# EAGLE design schematic_v1 (EAGLE 9.6.2)
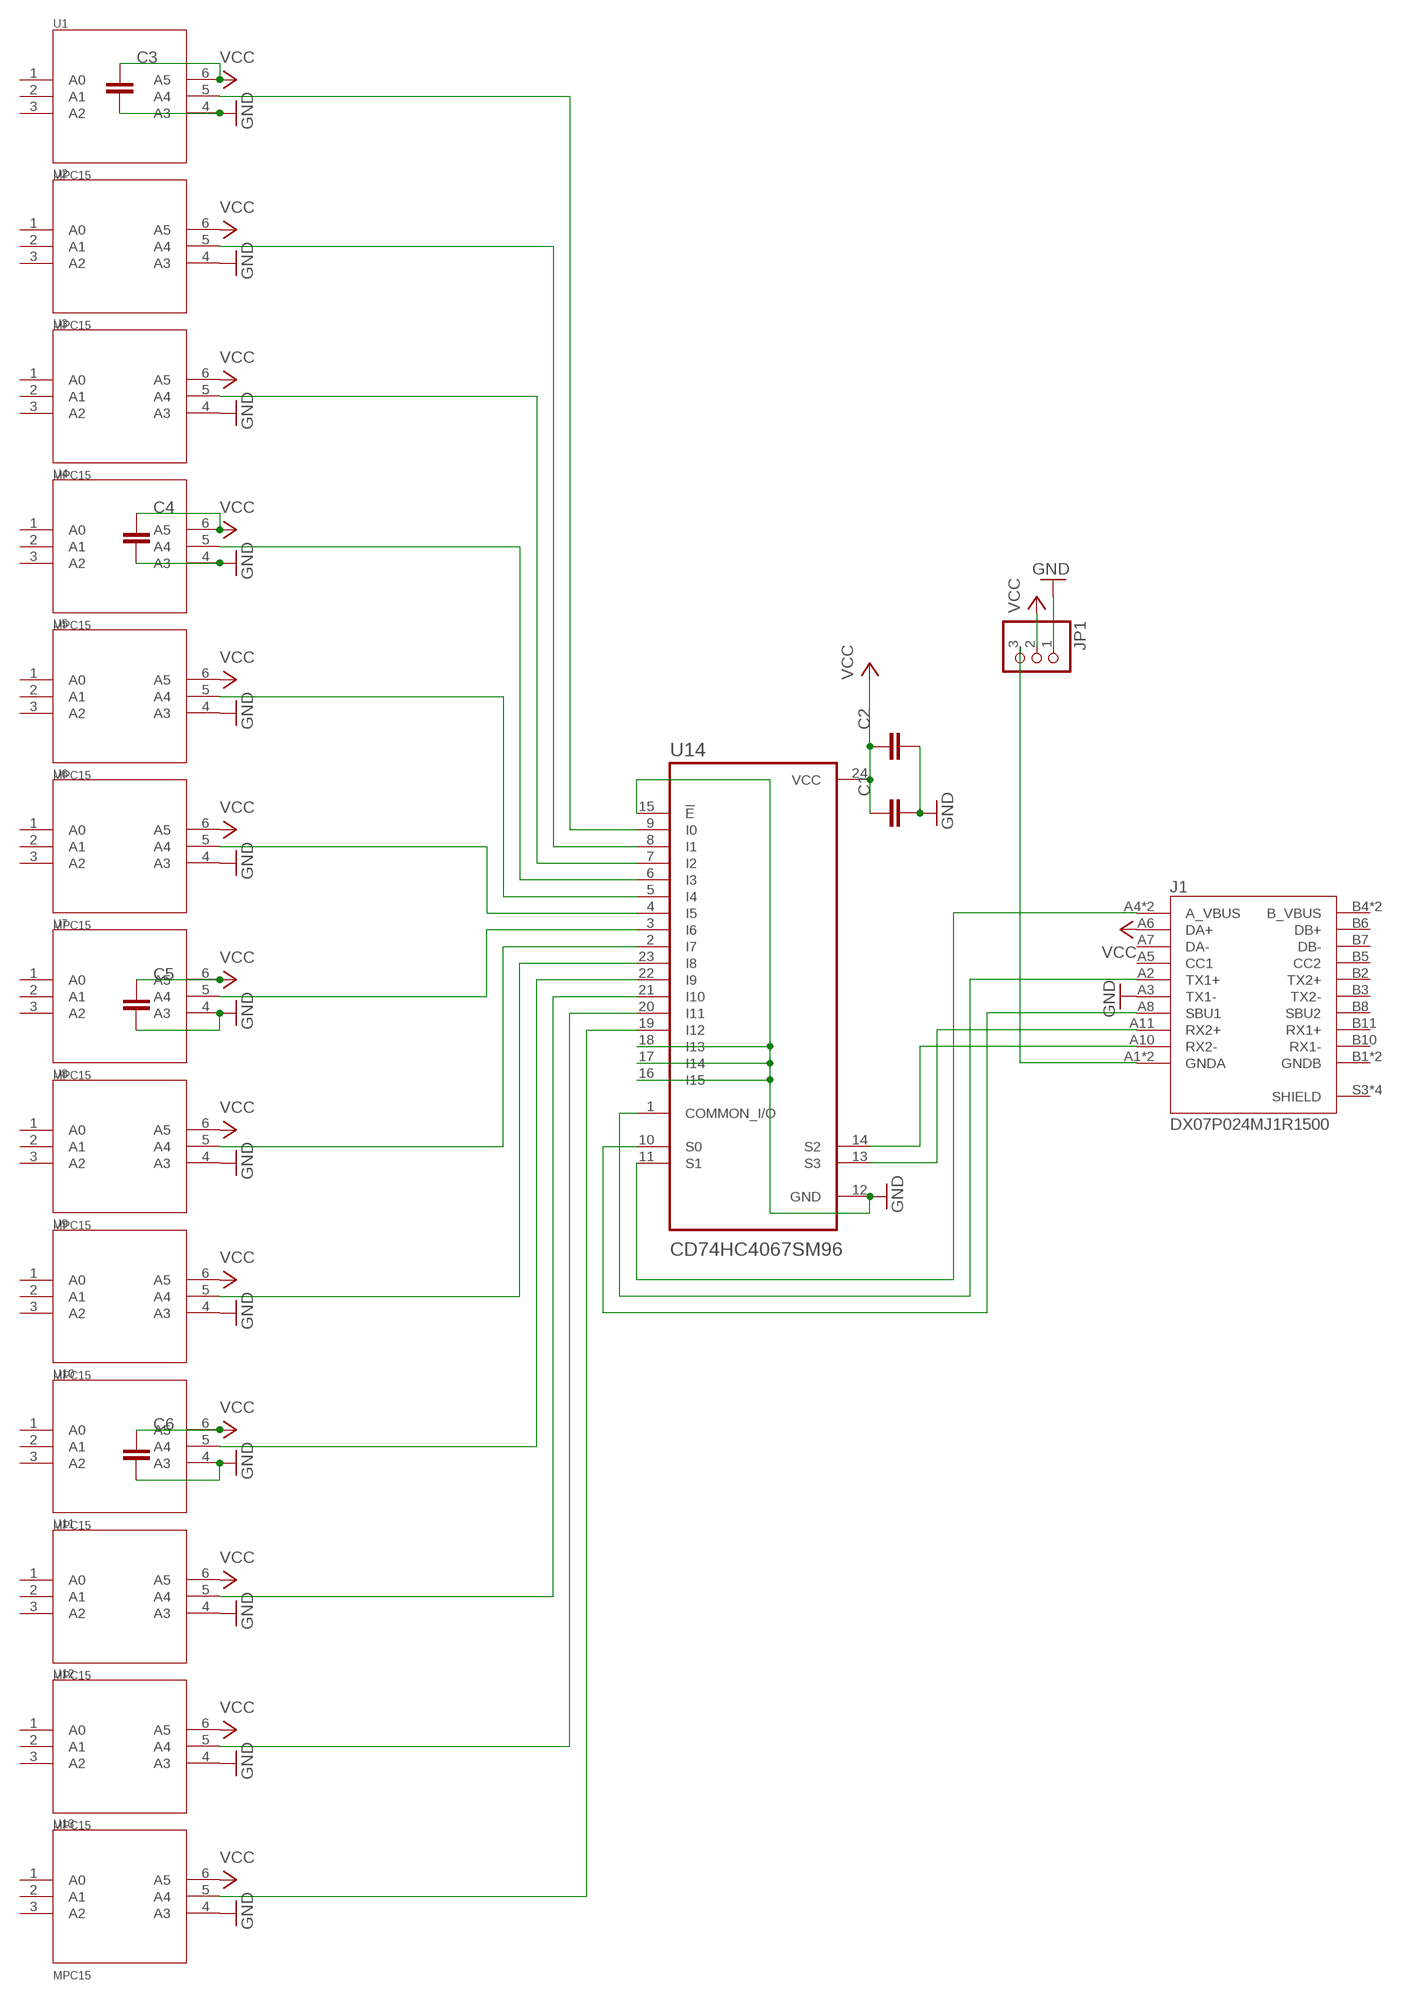
[diagram p0: schematic, sheet 1]

## Parts
C1  C_CHIP-0805(2012-METRIC)  [CAPC2012X110]
C2  C_CHIP-0805(2012-METRIC)  [CAPC2012X110]
C3  C_CHIP-0805(2012-METRIC)  [CAPC2012X110]
C4  C_CHIP-0805(2012-METRIC)  [CAPC2012X110]
C5  C_CHIP-0805(2012-METRIC)  [CAPC2012X110]
C6  C_CHIP-0805(2012-METRIC)  [CAPC2012X110]
J1  DX07P024MJ1R1500  [JAE_DX07P024MJ1R1500]
JP1  PINHD-1X3/90  [1X03/90]
U1  MPC15  [DIP1000W53P254L850H340Q6B]
U2  MPC15  [DIP1000W53P254L850H340Q6B]
U3  MPC15  [DIP1000W53P254L850H340Q6B]
U4  MPC15  [DIP1000W53P254L850H340Q6B]
U5  MPC15  [DIP1000W53P254L850H340Q6B]
U6  MPC15  [DIP1000W53P254L850H340Q6B]
U7  MPC15  [DIP1000W53P254L850H340Q6B]
U8  MPC15  [DIP1000W53P254L850H340Q6B]
U9  MPC15  [DIP1000W53P254L850H340Q6B]
U10  MPC15  [DIP1000W53P254L850H340Q6B]
U11  MPC15  [DIP1000W53P254L850H340Q6B]
U12  MPC15  [DIP1000W53P254L850H340Q6B]
U13  MPC15  [DIP1000W53P254L850H340Q6B]
U14  CD74HC4067SM96  [SOP65P780X200-24N]

## Nets
GND [power]: C1.2 C2.2 C3.2 C4.2 C5.2 C6.2 J1.A3(TX1-) JP1.1 U1.4(A3) U2.4(A3) U3.4(A3) U4.4(A3) U5.4(A3) U6.4(A3) U7.4(A3) U8.4(A3) U9.4(A3) U10.4(A3) U11.4(A3) U12.4(A3) U13.4(A3) U14.12(GND) U14.15(!E) U14.16(I15) U14.17(I14) U14.18(I13)
N$1: U1.5(A4) U14.9(I0)
N$2: U2.5(A4) U14.8(I1)
N$3: U3.5(A4) U14.7(I2)
N$4: U4.5(A4) U14.6(I3)
N$5: U5.5(A4) U14.5(I4)
N$6: U6.5(A4) U14.4(I5)
N$7: U7.5(A4) U14.3(I6)
N$8: U8.5(A4) U14.2(I7)
N$9: U9.5(A4) U14.23(I8)
N$10: U10.5(A4) U14.22(I9)
N$11: U11.5(A4) U14.21(I10)
N$12: U12.5(A4) U14.20(I11)
N$13: U13.5(A4) U14.19(I12)
N$14: J1.A4(A_VBUS) J1.A9(A_VBUS) U14.11(S1)
N$15: J1.A2(TX1+) U14.1(COMMON_I/O)
N$16: J1.A8(SBU1) U14.10(S0)
N$17: J1.A11(RX2+) U14.13(S3)
N$18: J1.A10(RX2-) U14.14(S2)
N$19: J1.A1(GNDA) J1.A12(GNDA) JP1.3
VCC [power]: C1.1 C2.1 C3.1 C4.1 C5.1 C6.1 J1.A6(DA+) JP1.2 U1.6(A5) U2.6(A5) U3.6(A5) U4.6(A5) U5.6(A5) U6.6(A5) U7.6(A5) U8.6(A5) U9.6(A5) U10.6(A5) U11.6(A5) U12.6(A5) U13.6(A5) U14.24(VCC)
Unconnected: J1.A5(CC1) J1.A7(DA-) J1.B2(TX2+) J1.B3(TX2-) J1.B5(CC2) J1.B6(DB+) J1.B7(DB-) J1.B8(SBU2) J1.B10(RX1-) J1.B11(RX1+) U1.1(A0) U1.2(A1) U1.3(A2) U2.1(A0) U2.2(A1) U2.3(A2) U3.1(A0) U3.2(A1) U3.3(A2) U4.1(A0) U4.2(A1) U4.3(A2) U5.1(A0) U5.2(A1) U5.3(A2) U6.1(A0) U6.2(A1) U6.3(A2) U7.1(A0) U7.2(A1) U7.3(A2) U8.1(A0) U8.2(A1) U8.3(A2) U9.1(A0) U9.2(A1) U9.3(A2) U10.1(A0) U10.2(A1) U10.3(A2) U11.1(A0) U11.2(A1) U11.3(A2) U12.1(A0) U12.2(A1) U12.3(A2) U13.1(A0) U13.2(A1) U13.3(A2)

## Power pins joined to a net without a drawn wire
B_VBUS: J1.B4(B_VBUS) J1.B9(B_VBUS)
GNDB: J1.B1(GNDB) J1.B12(GNDB)
SHIELD: J1.S3(SHIELD) J1.S4(SHIELD) J1.S5(SHIELD) J1.S6(SHIELD)

## Library data of the parts
C1-C6 = Capacitor:C: Capacitor - Generic; CATEGORY: Capacitor
J1 = DX07P024MJ1R1500:DX07P024MJ1R1500: Cut Tape - Usb Type c Receptacle Top Mnt Dual r Check prices <https://snapeda.com/parts/DX07P024MJ1R1500/JAE%20Electronics/view-part/?ref=eda>; AVAILABILITY: Warning; DESCRIPTION: USB-C (USB TYPE-C) USB 3.2 Gen 2 (USB 3.1 Gen 2, Superspeed + (USB 3.1)) Plug Connector 24 Position Board Edge, Straddle Mount; DIGIKEY-PURCHASE-URL: https://snapeda.com/shop?store=DigiKey&id=480323; MF: JAE Electronics; MOUSER-PURCHASE-URL: https://snapeda.com/shop?store=Mouser&id=480323; MP: DX07P024MJ1R1500; PACKAGE: None; PRICE: None
JP1 = pinhead:PINHD-1X3: PIN HEADER
U1-U13 = MPC15_v6:MPC15
U14 = CD74HC4067SM96:CD74HC4067SM96: Check prices <https://snapeda.com/parts/CD74HC4067SM96/Texas%20Instruments/view-part/?ref=eda>; AVAILABILITY: Good; DESCRIPTION: 5-V, 16:1, 1-channel analog multiplexer 24-SSOP -55 to 125; DIGIKEY-PURCHASE-URL: https://snapeda.com/shop?store=DigiKey&id=329941; MF: Texas Instruments; MOUSER-PURCHASE-URL: https://snapeda.com/shop?store=Mouser&id=329941; MP: CD74HC4067SM96; PACKAGE: SSOP-24 Texas Instruments; PRICE: None; TEXAS_INSTRUMENTS-PURCHASE-URL: https://snapeda.com/shop?store=Texas+Instruments&id=329941

## Net classes
0 default: width 0.152 mm
1 power: width 0.762 mm

## Board
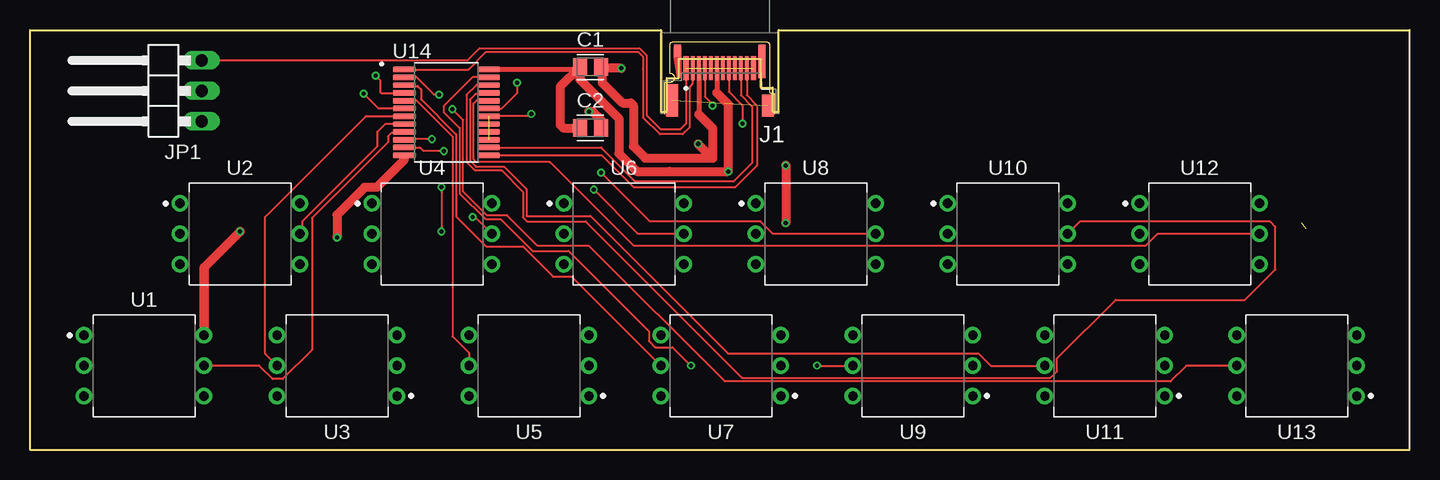
[diagram p1: board, top side]
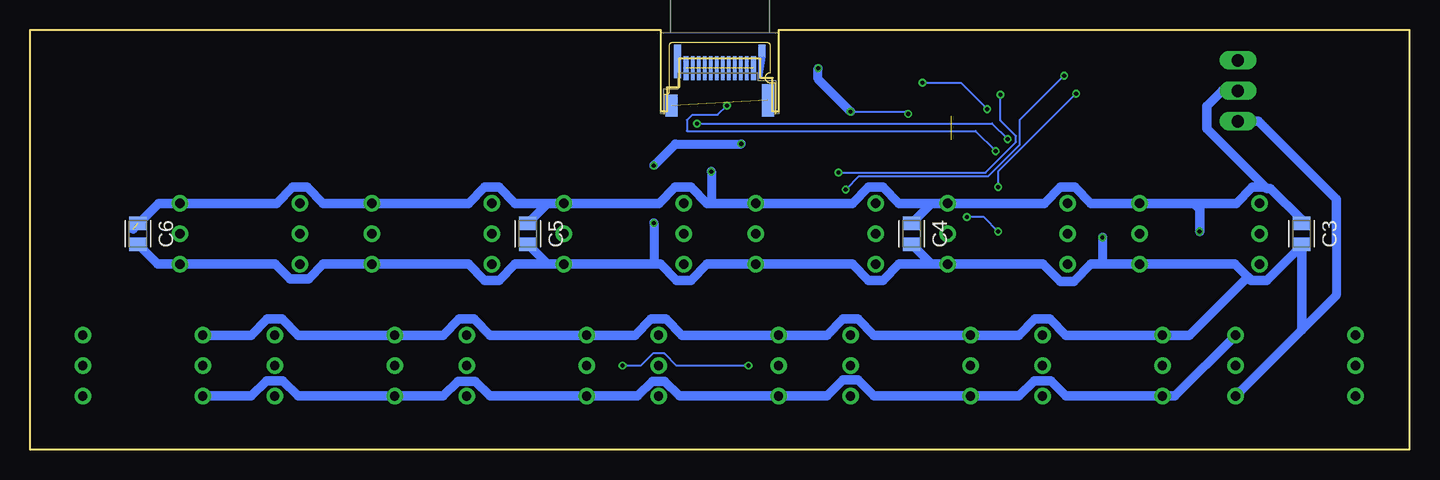
[diagram p2: board, bottom side, seen from below]

Size 115 x 35 mm. Coordinates in mm from the lower left corner, seen from the top.
Outline: 0,0 115,0 115,35 62.4,35 62.4,28.2 61.9,28.2 61.9,30.2 60.9,30.2 60.9,32.6 54.1,32.6 54.1,31 53.1,31 53.1,28.2 52.6,28.2 52.6,35 0,35 0,0
Copper layers (1*16): Top 0.035mm / dielectric 1.53mm / Bottom 0.035mm
Design rules "pban_5mil-l2": minimum track width 5mil, minimum drill 0.3mm, track to track 5mil, track to pad 0.229mm, pad to pad 5mil, via to via 5mil, smd to smd 5mil, copper to edge 0.5mm, drill to drill 0.5mm, minimum pad ring 0.15mm, minimum via ring 0.15mm, stop-mask expansion 4mil, vias tented up to drill 0.35mm, thermal gap 10mil

### Footprints (pad centres in the part's own frame; a part is rotated, then mirrored left to right if it is on the bottom)
CAPC2012X110 = smd 1.165 x 1.465: 1 -0.875,0; 2 0.875,0
JAE_DX07P024MJ1R1500 = smd 0.41 x 2: A1 2.825,2.15; A12 -2.825,2.15 | smd 0.26 x 2: A2 2.25,2.15; A3 1.75,2.15; A4 1.25,2.15; A5 0.75,2.15; A6 0.25,2.15; A7 -0.25,2.15; A8 -0.75,2.15; A9 -1.25,2.15; A10 -1.75,2.15; A11 -2.25,2.15 | smd 0.41 x 2 bottom: B1 -2.825,2.15; B12 2.825,2.15 | smd 0.26 x 2 bottom: B2 -2.25,2.15; B3 -1.75,2.15; B4 -1.25,2.15; B5 -0.75,2.15; B6 -0.25,2.15; B7 0.25,2.15; B8 0.75,2.15; B9 1.25,2.15; B10 1.75,2.15; B11 2.25,2.15 | smd 0.575 x 2.8: S1 -3.513,1.6 | smd 0.575 x 1: S2 3.513,0.7 | smd 1 x 1.8: S3 -4.025,5.275 | smd 1 x 2.7: S4 4,4.825 | smd 1 x 2.7 bottom: S5 4,4.825 | smd 1 x 1.8 bottom: S6 -4.025,5.275 | smd 0.575 x 2.8 bottom: S7 -3.513,1.6 | smd 0.575 x 1 bottom: S8 3.513,0.7
1X03/90 = drill 1.016 long: 1 -2.54,-3.81; 2 0,-3.81; 3 2.54,-3.81
DIP1000W53P254L850H340Q6B = drill 0.774 pad 1.374: 1 -5,2.54; 2 -5,0; 3 -5,-2.54; 4 5,-2.54; 5 5,0; 6 5,2.54
SOP65P780X200-24N = smd 1.9 x 0.48: 1 -3.505,3.575; 2 -3.505,2.925; 3 -3.505,2.275; 4 -3.505,1.625; 5 -3.505,0.975; 6 -3.505,0.325; 7 -3.505,-0.325; 8 -3.505,-0.975; 9 -3.505,-1.625; 10 -3.505,-2.275; 11 -3.505,-2.925; 12 -3.505,-3.575; 13 3.505,-3.575; 14 3.505,-2.925; 15 3.505,-2.275; 16 3.505,-1.625; 17 3.505,-0.975; 18 3.505,-0.325; 19 3.505,0.325; 20 3.505,0.975; 21 3.505,1.625; 22 3.505,2.275; 23 3.505,2.925; 24 3.505,3.575

### Placement (x,y rotation side)
C1  46.72,31.91 0 top
C2  46.72,26.83 0 top
C3  9,18 270 bottom
C4  41.5,18 270 bottom
C5  73.5,18 270 bottom
C6  106,18 270 bottom
J1  57.5,33.96 180 top
JP1  10.49,29.92 90 top
U1  9.5,7 0 top
U2  17.5,18 0 top
U3  25.6,7 180 top
U4  33.5,18 0 top
U5  41.6,7 180 top
U6  49.5,18 0 top
U7  57.6,7 180 top
U8  65.5,18 0 top
U9  73.6,7 180 top
U10  81.5,18 0 top
U11  89.6,7 180 top
U12  97.5,18 0 top
U13  105.6,7 180 top
U14  34.72,28.12 0 top

### Tracks (layer width: path | path; a pad name or v marks a point on that pad's centre or on a via)
B_VBUS  (1 unrouted)
GND  (via drill 0.35)  (3 unrouted)
  Top 0.152: C2.2 47.59,27.5 | 47.7,31.8 C1.2 | U14.12 31.21,24.2 31.21,24.18 | U14.18 41.6,27.8 v41.8,28
  Top 0.406: J1.A3 55.75,27.95
  Top 0.762: 47.59,27.5 46.9,28.2 v46.6,28.2 | v49.3,31.8 47.7,31.8 | 31.21,24.2 28.88,21.86 27.89,21.86 25.6,19.57 v25.6,17.7 | 56.9,24.31 56.9,26.8 55.75,27.95 | C1.2 47.7,31.8 47.7,30.6 49.4,28.9 50.1,28.9 50.3,28.7 50.3,25.3 51.29,24.31 56.9,24.31 | 56.9,24.31 v55.71,25.5 v55.7,25.5 | v63,23.7 v63,18.9
  Bottom 0.152: v46.6,28.2 42,28.2 v41.8,28
  Bottom 0.762: v46.6,28.2 49.3,30.9 v49.3,31.8 | v25.6,17.7 25.6,15.66 25.4,15.46 | v55.7,25.5 61.2,25.5 v63,23.7 | v63,18.9 63,15.46 | 6.12,17.14 6.12,12.85 9,9.96
  Bottom 0.8: C6.2 104.33,15.46 U12.4 94.55,15.46 93.31,14.22 91.79,14.22 90.55,15.46 U10.4 78.45,15.46 77.11,14.12 75.89,14.12 74.55,15.46 U8.4 | U8.4 63,15.46 62.45,15.46 61.11,14.12 59.89,14.12 58.55,15.46 U6.4 46.45,15.46 45.11,14.12 43.89,14.12 42.55,15.46 U4.4 | U4.4 30.55,15.46 29.11,14.02 27.99,14.02 26.55,15.46 25.4,15.46 U2.4 14.55,15.46 13.5,14.4 | 13.5,14.4 13.21,14.12 11.9,14.12 9,17.02 C3.2 | U1.4 9,9.96 C3.2 | 13.5,14.4 18.36,9.54 U3.4 28.65,9.54 29.99,10.88 31.21,10.88 32.55,9.54 U5.4 44.65,9.54 45.99,10.88 47.21,10.88 48.55,9.54 U7.4 60.65,9.54 61.99,10.88 63.21,10.88 64.55,9.54 U9.4 76.65,9.54 77.99,10.88 79.21,10.88 80.55,9.54 U11.4 92.65,9.54 93.99,10.88 95.21,10.88 96.55,9.54 U13.4 | U4.4 39.84,15.46 C4.2 | U8.4 71.83,15.46 C5.2 | C3.2 8.98,17.14 | 6.12,17.14 6.12,20.89 12.6,27.38 JP1.1
GNDB  (1 unrouted)
N$1
  Top 0.152: U14.9 31.13,26.41 30.11,26.41 29.84,26.14 29.84,25.64 23.52,19.32 23.52,8.32 21.08,5.88 20.22,5.88 19.11,7 U1.5
N$2
  Top 0.152: U2.5 22.7,18.2 22.7,19.03 28.94,25.27 28.94,26.5 29.61,27.16 31.2,27.16 U14.8
N$3
  Top 0.152: U14.7 31.2,27.81 28,27.81 19.61,19.42 19.61,7.99 U3.5
N$4  (via drill 0.35)
  Top 0.152: U14.6 29.05,28.45 v27.8,29.7 | v34.3,21.9 v34.3,18.2 | v36.9,19.4 37.1,19.4 U4.5
  Bottom 0.152: v27.8,29.7 34.3,23.2 v34.3,21.9 | v34.3,18.2 35.5,19.4 v36.9,19.4
N$5
  Top 0.152: U14.5 31.23,29.11 32.23,29.11 35.22,26.12 35.22,9.44 36.6,8.05 U5.5
N$6  (via drill 0.35)
  Top 0.152: U6.5 50.7,18 v47,21.7 | v28.8,31.2 29.2,30.8 29.2,29.8 29.25,29.75 U14.4
  Bottom 0.152: v47,21.7 45.91,22.8 35.12,22.8 32.49,25.42 32.49,27.51 v28.8,31.2
N$7
  Top 0.152: U14.3 31.3,30.31 32.33,30.31 32.59,30.05 32.59,29.22 35.52,26.29 35.52,19.43 38.01,16.95 41.09,16.95 43.6,14.43 45.17,14.43 U7.5
N$8  (via drill 0.35)
  Top 0.152: U8.5 61.93,18 60.91,19.02 51.68,19.02 v47.6,23.1 | U14.2 31.23,31.06 32.23,31.06 33.69,29.6 v34.1,29.6
  Bottom 0.152: v47.6,23.1 35.34,23.1 32.79,25.65 32.79,26.15 34.1,27.46 v34.1,29.6
N$9  (via drill 0.35)
  Top 0.152: v55.1,7 53.58,8.52 52.12,8.52 51.58,9.06 51.58,9.87 44.88,16.58 41.89,16.58 39.25,19.22 37.98,19.22 35.83,21.37 35.83,26.82 34.49,28.15 34.49,28.65 36.91,31.06 38.21,31.06 U14.23 | v65.6,7 U9.5
  Bottom 0.152: v55.1,7 61.1,7 62.12,8.02 63.08,8.02 64.09,7 v65.6,7
N$10
  Top 0.152: U14.22 38.21,30.41 37.22,30.41 36.39,29.59 36.39,23.99 37.08,23.3 39.3,23.3 41.1,21.5 41.1,19.36 41.43,19.04 46.32,19.04 59.37,5.98 85.08,5.98 85.62,6.52 85.62,7.62 90.5,12.5 90.5,12.48 101.27,12.48 103.82,15.02 103.82,18.58 103.38,19.02 87.52,19.02 U10.5
N$11
  Top 0.152: U14.21 38.14,29.66 37.14,29.66 36.67,29.19 36.67,24.1 37.18,23.6 39.5,23.6 41.38,21.72 41.38,19.48 46.71,19.48 58.17,8.02 79.08,8.02 80.09,7 U11.5
N$12
  Top 0.152: U12.5 94,18 92.98,16.98 50.34,16.98 43.34,23.98 37.2,23.98 36.96,24.21 36.96,28.86 37.22,29.11 38.21,29.11 U14.20
N$13  (via drill 0.35)
  Top 0.152: v35.2,28.4 36.11,27.49 36.11,21.5 38.09,19.52 39.77,19.52 42.3,17 46.6,17 57.92,5.68 95.07,5.68 96.39,7 U13.5 | v40.6,30.6 40.6,29.72 39.33,28.45 U14.19
  Bottom 0.152: v40.6,30.6 37.4,30.6 v35.2,28.4
N$14  (via drill 0.35)  (1 unrouted)
  Top 0.152: J1.A4 56.25,29.45 56.9,28.8 v56.9,28.7 | v34.5,24.9 32.8,24.9 32.5,25.2 U14.11
  Bottom 0.152: v56.9,28.7 57.67,27.93 59.78,27.93 60.23,27.48 60.23,26.57 36.17,26.57 v34.5,24.9
N$15
  Top 0.152: U14.1 36.55,31.7 38.02,33.17 50.69,33.17 51.11,32.75 51.11,31.75 51.1,31.74 51.1,27.7 52.5,26.3 54.4,26.3 55,26.9 55,30.25 55.27,30.52 55.27,31.79 J1.A2
N$16  (via drill 0.35)
  Top 0.152: v33.5,25.9 31.27,25.9 U14.10 | J1.A8 58.25,29.85 59.4,28.7 v59.4,27.2
  Bottom 0.152: v59.4,27.2 34.8,27.2 v33.5,25.9
N$17
  Top 0.152: J1.A11 59.75,29.55 60.6,28.7 60.6,23.7 58.8,21.9 50.3,21.9 47.66,24.55 U14.13
N$18
  Top 0.152: J1.A10 59.25,29.55 60.2,28.6 60.2,23.9 58.7,22.4 50.4,22.4 47.6,25.2 U14.14
N$19  (1 unrouted)
  Top 0.152: J1.A1 54.67,27.18 54.2,26.7 52.6,26.7 51.41,27.89 51.41,32.88 50.81,33.48 37.5,33.48 36.48,32.46 JP1.3
SHIELD  (3 unrouted)
VCC  (via drill 0.35)  (1 unrouted)
  Top 0.152: J1.A6 57.3,31.76 | C1.1 45.74,31.91 45.53,31.7
  Top 0.406: 45.53,31.7 U14.24 | J1.A6 57.25,29.75
  Top 0.762: 57.25,29.75 58.2,28.8 v58.2,23.2 v58.19,23.21 53.35,23.21 53.34,23.2 50.6,23.2 49.1,24.7 49.1,27.6 45.84,30.86 C1.1 44.2,30.27 44.2,27.1 44.47,26.83 C2.1
  Top 0.8: U1.6 14.5,15.2 v17.5,18.2
  Bottom 0.762: v58.2,23.2 58.2,20.54
  Bottom 0.8: 18,20.54 14.45,20.54 13.11,21.88 12,21.88 | 18,20.54 U2.6 26.55,20.54 27.89,21.88 29.11,21.88 30.45,20.54 U4.6 | C3.1 9,19.18 11.6,21.78 11.9,21.78 12,21.88 | U4.6 42.55,20.54 43.89,21.88 45.11,21.88 46.45,20.54 U6.6 58.2,20.54 58.55,20.54 59.89,21.88 61.21,21.88 62.55,20.54 U8.6 | U8.6 74.55,20.54 75.89,21.88 77.11,21.88 78.45,20.54 U10.6 90.55,20.54 91.89,21.88 93.11,21.88 94.45,20.54 U12.6 104.26,20.54 106.4,18.4 | U1.6 19.58,4.46 U3.6 28.65,4.46 29.92,5.73 31.28,5.73 32.55,4.46 U5.6 44.65,4.46 45.99,5.8 47.21,5.8 48.55,4.46 U7.6 60.85,4.46 62.09,5.7 63.11,5.7 64.35,4.46 U9.6 76.65,4.46 77.89,5.7 79.31,5.7 80.55,4.46 U11.6 92.65,4.46 93.92,5.74 95.28,5.74 96.55,4.46 U13.6 | C4.1 39.84,20.54 U4.6 | U8.6 71.83,20.54 C5.1 | JP1.2 15.6,29.92 16.88,28.64 16.88,26.75 12,21.88 | v17.5,18.2 17.5,20.04 18,20.54